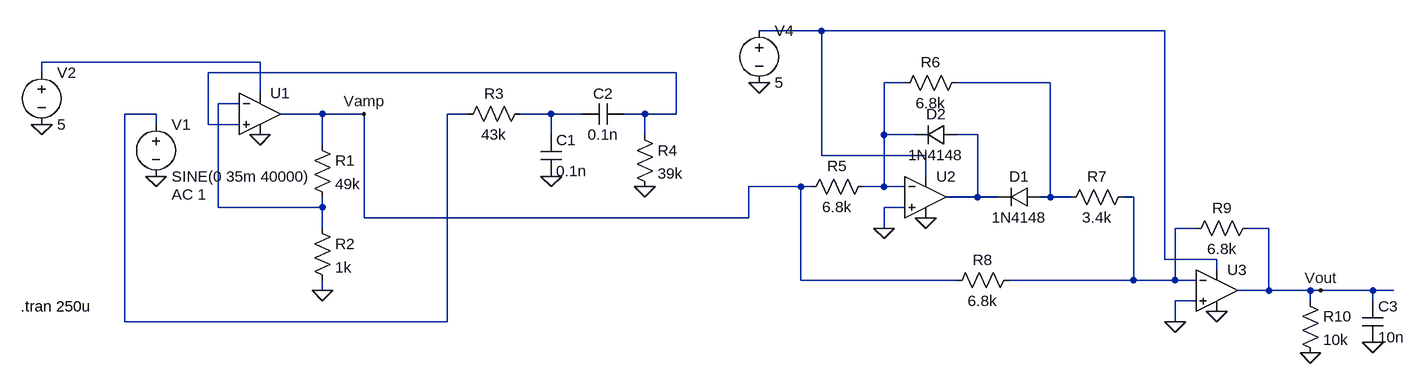
[diagram p0: schematic Ultrasonic Full Circuit v4.asc]
Ultrasonic Full Circuit v4.asc, the LTspice schematic file:
Version 4.1
SHEET 1 1752 680
WIRE 848 -64 752 -64
WIRE 1376 -64 848 -64
WIRE -16 -16 -352 -16
WIRE -352 0 -352 -16
WIRE 624 0 -96 0
WIRE 976 16 944 16
WIRE 1200 16 1056 16
WIRE -16 32 -16 -16
WIRE -48 48 -80 48
WIRE -176 64 -224 64
WIRE 80 64 16 64
WIRE 144 64 80 64
WIRE 304 64 272 64
WIRE 432 64 384 64
WIRE 480 64 432 64
WIRE 576 64 544 64
WIRE 624 64 624 0
WIRE 624 64 576 64
WIRE -176 80 -176 64
WIRE -96 80 -96 0
WIRE -48 80 -96 80
WIRE 432 96 432 64
WIRE 576 96 576 64
WIRE 944 96 944 16
WIRE 992 96 944 96
WIRE 1088 96 1056 96
WIRE 80 112 80 64
WIRE 848 128 848 -64
WIRE 1008 128 848 128
WIRE 1008 160 1008 128
WIRE 816 176 736 176
WIRE 832 176 816 176
WIRE 944 176 944 96
WIRE 944 176 912 176
WIRE 976 176 944 176
WIRE 1088 192 1088 96
WIRE 1088 192 1040 192
WIRE 1120 192 1088 192
WIRE 1200 192 1200 16
WIRE 1200 192 1184 192
WIRE 1232 192 1200 192
WIRE 1328 192 1312 192
WIRE -80 208 -80 48
WIRE 80 208 80 192
WIRE 80 208 -80 208
WIRE 976 208 944 208
WIRE 144 224 144 64
WIRE 736 224 736 176
WIRE 736 224 144 224
WIRE 80 240 80 208
WIRE 944 240 944 208
WIRE 1424 240 1392 240
WIRE 1536 240 1504 240
WIRE 1376 288 1376 -64
WIRE 1456 288 1376 288
WIRE 1456 304 1456 288
WIRE 816 320 816 176
WIRE 1056 320 816 320
WIRE 1328 320 1328 192
WIRE 1328 320 1136 320
WIRE 1392 320 1392 240
WIRE 1392 320 1328 320
WIRE 1424 320 1392 320
WIRE 80 336 80 320
WIRE 1536 336 1536 240
WIRE 1536 336 1488 336
WIRE 1600 336 1536 336
WIRE 1616 336 1600 336
WIRE 1696 336 1616 336
WIRE 1728 336 1696 336
WIRE 1424 352 1392 352
WIRE 1600 352 1600 336
WIRE 1696 352 1696 336
WIRE -224 384 -224 64
WIRE 272 384 272 64
WIRE 272 384 -224 384
WIRE 1392 384 1392 352
FLAG 80 336 0
FLAG 144 64 Vamp
FLAG -176 160 0
FLAG -352 80 0
FLAG -16 96 0
FLAG 576 176 0
FLAG 432 160 0
FLAG 944 240 0
FLAG 1008 224 0
FLAG 1392 384 0
FLAG 1456 368 0
FLAG 1616 336 Vout
FLAG 752 16 0
FLAG 1696 416 0
FLAG 1600 432 0
SYMBOL res 64 96 R0
SYMATTR InstName R1
SYMATTR Value 49k
SYMBOL res 64 224 R0
SYMATTR InstName R2
SYMATTR Value 1k
SYMBOL voltage -176 64 R0
WINDOW 123 24 124 Left 2
WINDOW 39 0 0 Left 0
SYMATTR Value2 AC 1
SYMATTR InstName V1
SYMATTR Value SINE(0 35m 40000)
SYMBOL voltage -352 -16 R0
SYMATTR InstName V2
SYMATTR Value 5
SYMBOL OpAmps\\UniversalOpAmp -16 64 R0
SYMATTR InstName U1
SYMBOL res 400 48 R90
WINDOW 0 0 56 VBottom 2
WINDOW 3 32 56 VTop 2
SYMATTR InstName R3
SYMATTR Value 43k
SYMBOL cap 416 96 R0
SYMATTR InstName C1
SYMATTR Value 0.1n
SYMBOL cap 544 48 R90
WINDOW 0 0 32 VBottom 2
WINDOW 3 32 32 VTop 2
SYMATTR InstName C2
SYMATTR Value 0.1n
SYMBOL res 560 80 R0
SYMATTR InstName R4
SYMATTR Value 39k
SYMBOL res 928 160 R90
WINDOW 0 0 56 VBottom 2
WINDOW 3 32 56 VTop 2
SYMATTR InstName R5
SYMATTR Value 6.8k
SYMBOL OpAmps\\UniversalOpAmp 1008 192 R0
SYMATTR InstName U2
SYMBOL diode 1184 176 R90
WINDOW 0 0 32 VBottom 2
WINDOW 3 32 32 VTop 2
SYMATTR InstName D1
SYMATTR Value 1N4148
SYMBOL diode 1056 80 R90
WINDOW 0 0 32 VBottom 2
WINDOW 3 32 32 VTop 2
SYMATTR InstName D2
SYMATTR Value 1N4148
SYMBOL res 1072 0 R90
WINDOW 0 0 56 VBottom 2
WINDOW 3 32 56 VTop 2
SYMATTR InstName R6
SYMATTR Value 6.8k
SYMBOL res 1328 176 R90
WINDOW 0 0 56 VBottom 2
WINDOW 3 32 56 VTop 2
SYMATTR InstName R7
SYMATTR Value 3.4k
SYMBOL OpAmps\\UniversalOpAmp 1456 336 R0
SYMATTR InstName U3
SYMBOL res 1152 304 R90
WINDOW 0 0 56 VBottom 2
WINDOW 3 32 56 VTop 2
SYMATTR InstName R8
SYMATTR Value 6.8k
SYMBOL res 1520 224 R90
WINDOW 0 0 56 VBottom 2
WINDOW 3 32 56 VTop 2
SYMATTR InstName R9
SYMATTR Value 6.8k
SYMBOL voltage 752 -80 R0
SYMATTR InstName V4
SYMATTR Value 5
SYMBOL res 1584 336 R0
SYMATTR InstName R10
SYMATTR Value 10k
SYMBOL cap 1680 352 R0
SYMATTR InstName C3
SYMATTR Value 10n
TEXT -384 360 Left 2 !.tran 250u

The netlist it stands for:
* Ultrasonic Full Circuit v4.asc
R1 Vamp N006 49k
R2 N006 0 1k
V1 N007 0 SINE(0 35m 40000) AC 1
V2 N002 0 5
X§U1 N003 N006 N002 0 Vamp level1 Avol=1Meg GBW=10Meg Vos=0 En=0 Enk=0 In=0 Ink=0 Rin=500Meg  ; pins In+ In- V+ V- OUT
R3 N008 N007 43k
C1 N008 0 0.1n
C2 N003 N008 0.1n
R4 N003 0 39k
R5 N004 Vamp 6.8k
X§U2 0 N004 N001 0 N009 level1 Avol=1Meg GBW=10Meg Vos=0 En=0 Enk=0 In=0 Ink=0 Rin=500Meg  ; pins In+ In- V+ V- OUT
D1 N005 N009 1N4148
D2 N009 N004 1N4148
R6 N005 N004 6.8k
R7 N010 N005 3.4k
X§U3 0 N010 N001 0 Vout level1 Avol=1Meg GBW=10Meg Vos=0 En=0 Enk=0 In=0 Ink=0 Rin=500Meg  ; pins In+ In- V+ V- OUT
R8 N010 Vamp 6.8k
R9 Vout N010 6.8k
V4 N001 0 5
R10 Vout 0 10k
C3 Vout 0 10n
.model D D
.lib standard.dio
.tran 250u
.lib UniversalOpAmp1.lib
.backanno
.end